# Altium schematic sheet LED7SEG.SchDoc
size A4
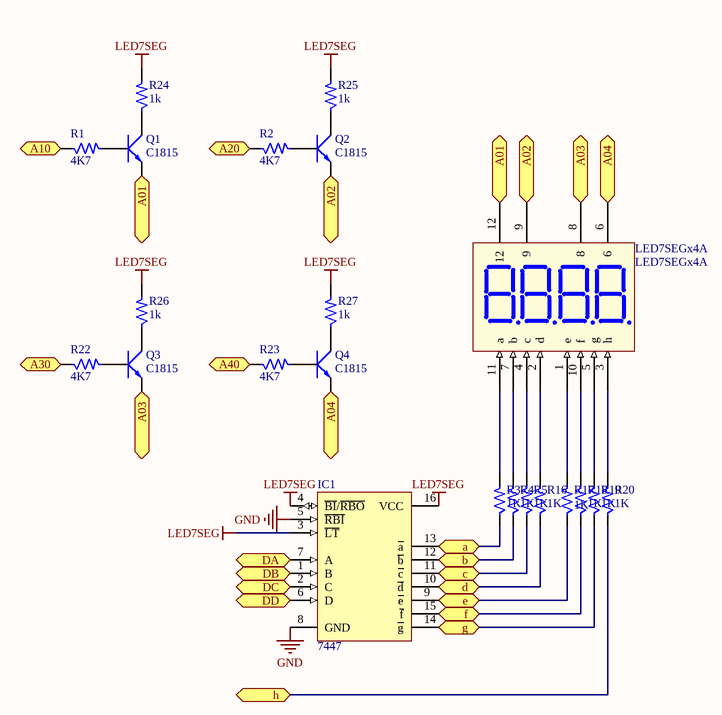
[diagram p0: LED7SEG.SchDoc]

## Parts
IC1  7447  [DIP16/W0.3]
LED7SEGx4A  LED7SEGx4A  [LED7SEGx4A]
Q1  C1815  [SOT23B]
Q2  C1815  [SOT23B]
Q3  C1815  [SOT23B]
Q4  C1815  [SOT23B]
R1  4K7  [SM-1206]
R2  4K7  [SM-1206]
R3  1K  [SM-1206]
R4  1K  [SM-1206]
R5  1K  [SM-1206]
R16  1K  [SM-1206]
R17  1K  [SM-1206]
R18  1K  [SM-1206]
R19  1K  [SM-1206]
R20  1K  [SM-1206]
R22  4K7  [SM-1206]
R23  4K7  [SM-1206]
R24  1k  [SM-1206]
R25  1k  [SM-1206]
R26  1k  [SM-1206]
R27  1k  [SM-1206]

## Ports
a, A01, A02, A03, A04, A10, A20, A30, A40, b, c, d, DA, DB, DC, DD, e, f, g, h

## Nets
GND: IC1.5(~{RBI}) IC1.8(GND)
LED7SEG: IC1.3(~{LT}) IC1.4(~{BI}/~{RBO}) IC1.16(VCC) R24.2 R25.2 R26.2 R27.2
a: IC1.13(~{a}) R3.1 ; port a
A01: LED7SEGx4A.12 Q1.1(E) ; port A01
A02: LED7SEGx4A.9 Q2.1(E) ; port A02
A03: LED7SEGx4A.8 Q3.1(E) ; port A03
A04: LED7SEGx4A.6 Q4.1(E) ; port A04
A10: R1.1 ; port A10
A20: R2.1 ; port A20
A30: R22.1 ; port A30
A40: R23.1 ; port A40
b: IC1.12(~{b}) R4.1 ; port b
c: IC1.11(~{c}) R5.1 ; port c
d: IC1.10(~{d}) R16.1 ; port d
DA: IC1.7(A) ; port DA
DB: IC1.1(B) ; port DB
DC: IC1.2(C) ; port DC
DD: IC1.6(D) ; port DD
e: IC1.9(~{e}) R17.1 ; port e
f: IC1.15(~{f}) R18.1 ; port f
g: IC1.14(~{g}) R19.1 ; port g
h: R20.1 ; port h
NetLED7SEGx4A_1: LED7SEGx4A.1(e) R17.2
NetLED7SEGx4A_2: LED7SEGx4A.2(d) R16.2
NetLED7SEGx4A_3: LED7SEGx4A.3(h) R20.2
NetLED7SEGx4A_4: LED7SEGx4A.4(c) R5.2
NetLED7SEGx4A_5: LED7SEGx4A.5(g) R19.2
NetLED7SEGx4A_7: LED7SEGx4A.7(b) R4.2
NetLED7SEGx4A_10: LED7SEGx4A.10(f) R18.2
NetLED7SEGx4A_11: LED7SEGx4A.11(a) R3.2
NetQ1_2: Q1.2(C) R24.1
NetQ1_3: Q1.3(B) R1.2
NetQ2_2: Q2.2(C) R25.1
NetQ2_3: Q2.3(B) R2.2
NetQ3_2: Q3.2(C) R26.1
NetQ3_3: Q3.3(B) R22.2
NetQ4_2: Q4.2(C) R27.1
NetQ4_3: Q4.3(B) R23.2

## Library data of the parts
IC1 = 7447: BCD to 7-Segment Decoder/Driver; Value: 7447 , 74247; Description: VanDungEvn
LED7SEGx4A = LED7SEGx4A: 0.36''
Q1-Q4 = C1815: NPN 600mW, ECB; Value: C1815
R1-R5 R16-R20 R23-R27 = R: Resistor 1/4W; Value: R1/4W - 1K
R22 = R: Resistor 1/4W; Value: R1/4W - 4K7